# Altium schematic sheet Tp_Main.SchDoc
size A4
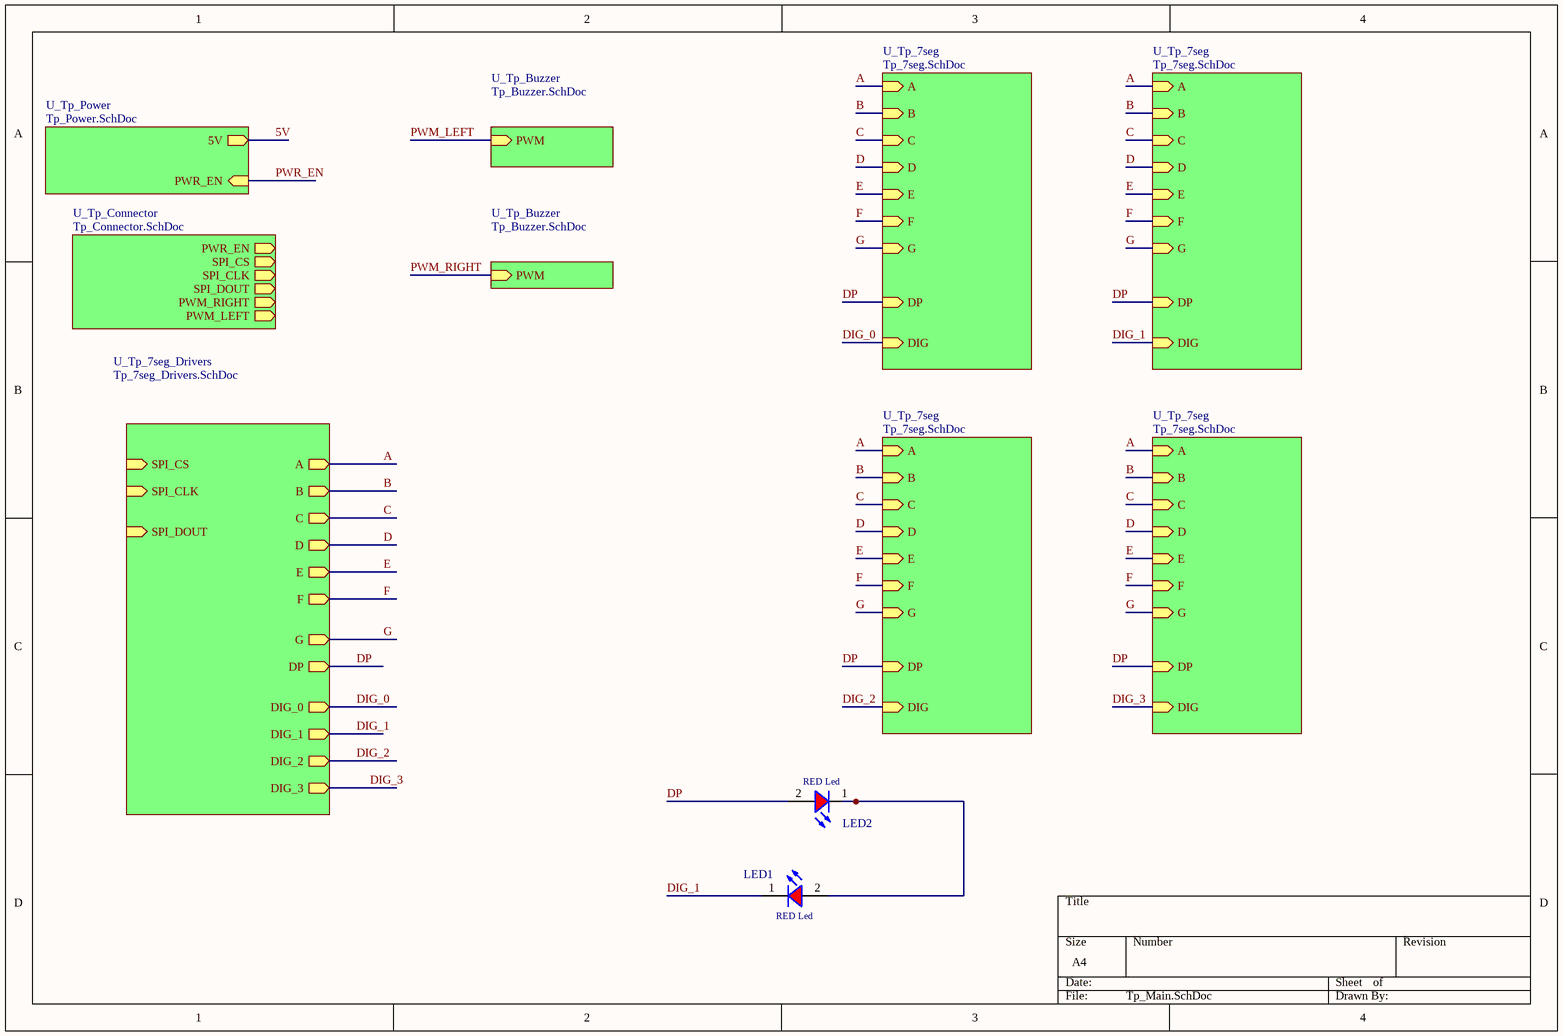
[diagram p0: Tp_Main.SchDoc]

## Parts
LED1  RED Led  [LED_0603_RED]
LED2  RED Led  [LED_0603_RED]

## Sub-sheets
U_Tp_7seg = Tp_7seg.SchDoc: A (in), B (in), C (in), D (in), E (in), F (in), G (in), DP (in), DIG (in)
U_Tp_7seg = Tp_7seg.SchDoc: A (in), B (in), C (in), D (in), E (in), F (in), G (in), DP (in), DIG (in)
U_Tp_7seg = Tp_7seg.SchDoc: A (in), B (in), C (in), D (in), E (in), F (in), G (in), DP (in), DIG (in)
U_Tp_7seg = Tp_7seg.SchDoc: A (in), B (in), C (in), D (in), E (in), F (in), G (in), DP (in), DIG (in)
U_Tp_7seg_Drivers = Tp_7seg_Drivers.SchDoc: D (out), B (out), C (out), E (out), F (out), G (out), DP (out), A (out), DIG_0 (out), DIG_1 (out), DIG_2 (out), DIG_3 (out), SPI_CS (in), SPI_CLK (in), SPI_DOUT (in)
U_Tp_Buzzer = Tp_Buzzer.SchDoc: PWM (in)
U_Tp_Buzzer = Tp_Buzzer.SchDoc: PWM (in)
U_Tp_Connector = Tp_Connector.SchDoc: PWR_EN (out), SPI_CS (out), SPI_CLK (out), SPI_DOUT (out), PWM_RIGHT (out), PWM_LEFT (out)
U_Tp_Power = Tp_Power.SchDoc: 5V (out), PWR_EN (in)

## Nets
5V: sheet U_Tp_Power/5V
A: sheet U_Tp_7seg/A, sheet U_Tp_7seg/A, sheet U_Tp_7seg/A, sheet U_Tp_7seg/A, sheet U_Tp_7seg_Drivers/A
B: sheet U_Tp_7seg/B, sheet U_Tp_7seg/B, sheet U_Tp_7seg/B, sheet U_Tp_7seg/B, sheet U_Tp_7seg_Drivers/B
C: sheet U_Tp_7seg/C, sheet U_Tp_7seg/C, sheet U_Tp_7seg/C, sheet U_Tp_7seg/C, sheet U_Tp_7seg_Drivers/C
D: sheet U_Tp_7seg/D, sheet U_Tp_7seg/D, sheet U_Tp_7seg/D, sheet U_Tp_7seg/D, sheet U_Tp_7seg_Drivers/D
DIG_0: sheet U_Tp_7seg/DIG, sheet U_Tp_7seg_Drivers/DIG_0
DIG_1: LED1.1(K) ; sheet U_Tp_7seg/DIG, sheet U_Tp_7seg_Drivers/DIG_1
DIG_2: sheet U_Tp_7seg/DIG, sheet U_Tp_7seg_Drivers/DIG_2
DIG_3: sheet U_Tp_7seg/DIG, sheet U_Tp_7seg_Drivers/DIG_3
DP: LED2.2(A) ; sheet U_Tp_7seg/DP, sheet U_Tp_7seg/DP, sheet U_Tp_7seg/DP, sheet U_Tp_7seg/DP, sheet U_Tp_7seg_Drivers/DP
E: sheet U_Tp_7seg/E, sheet U_Tp_7seg/E, sheet U_Tp_7seg/E, sheet U_Tp_7seg/E, sheet U_Tp_7seg_Drivers/E
F: sheet U_Tp_7seg/F, sheet U_Tp_7seg/F, sheet U_Tp_7seg/F, sheet U_Tp_7seg/F, sheet U_Tp_7seg_Drivers/F
G: sheet U_Tp_7seg/G, sheet U_Tp_7seg/G, sheet U_Tp_7seg/G, sheet U_Tp_7seg/G, sheet U_Tp_7seg_Drivers/G
PWM_LEFT: sheet U_Tp_Buzzer/PWM
PWM_RIGHT: sheet U_Tp_Buzzer/PWM
PWR_EN: sheet U_Tp_Power/PWR_EN
NetLED1_2: LED1.2(A) LED2.1(K)

## Library data of the parts
LED1 LED2 = LED_RED_SMD_WE_150060RS750x0: LED RED SMD WE 150060RS750x0; ref: 150060RS750x0